# Altium project Bass Guitar Amp.PrjPcb (part 3 of 4)
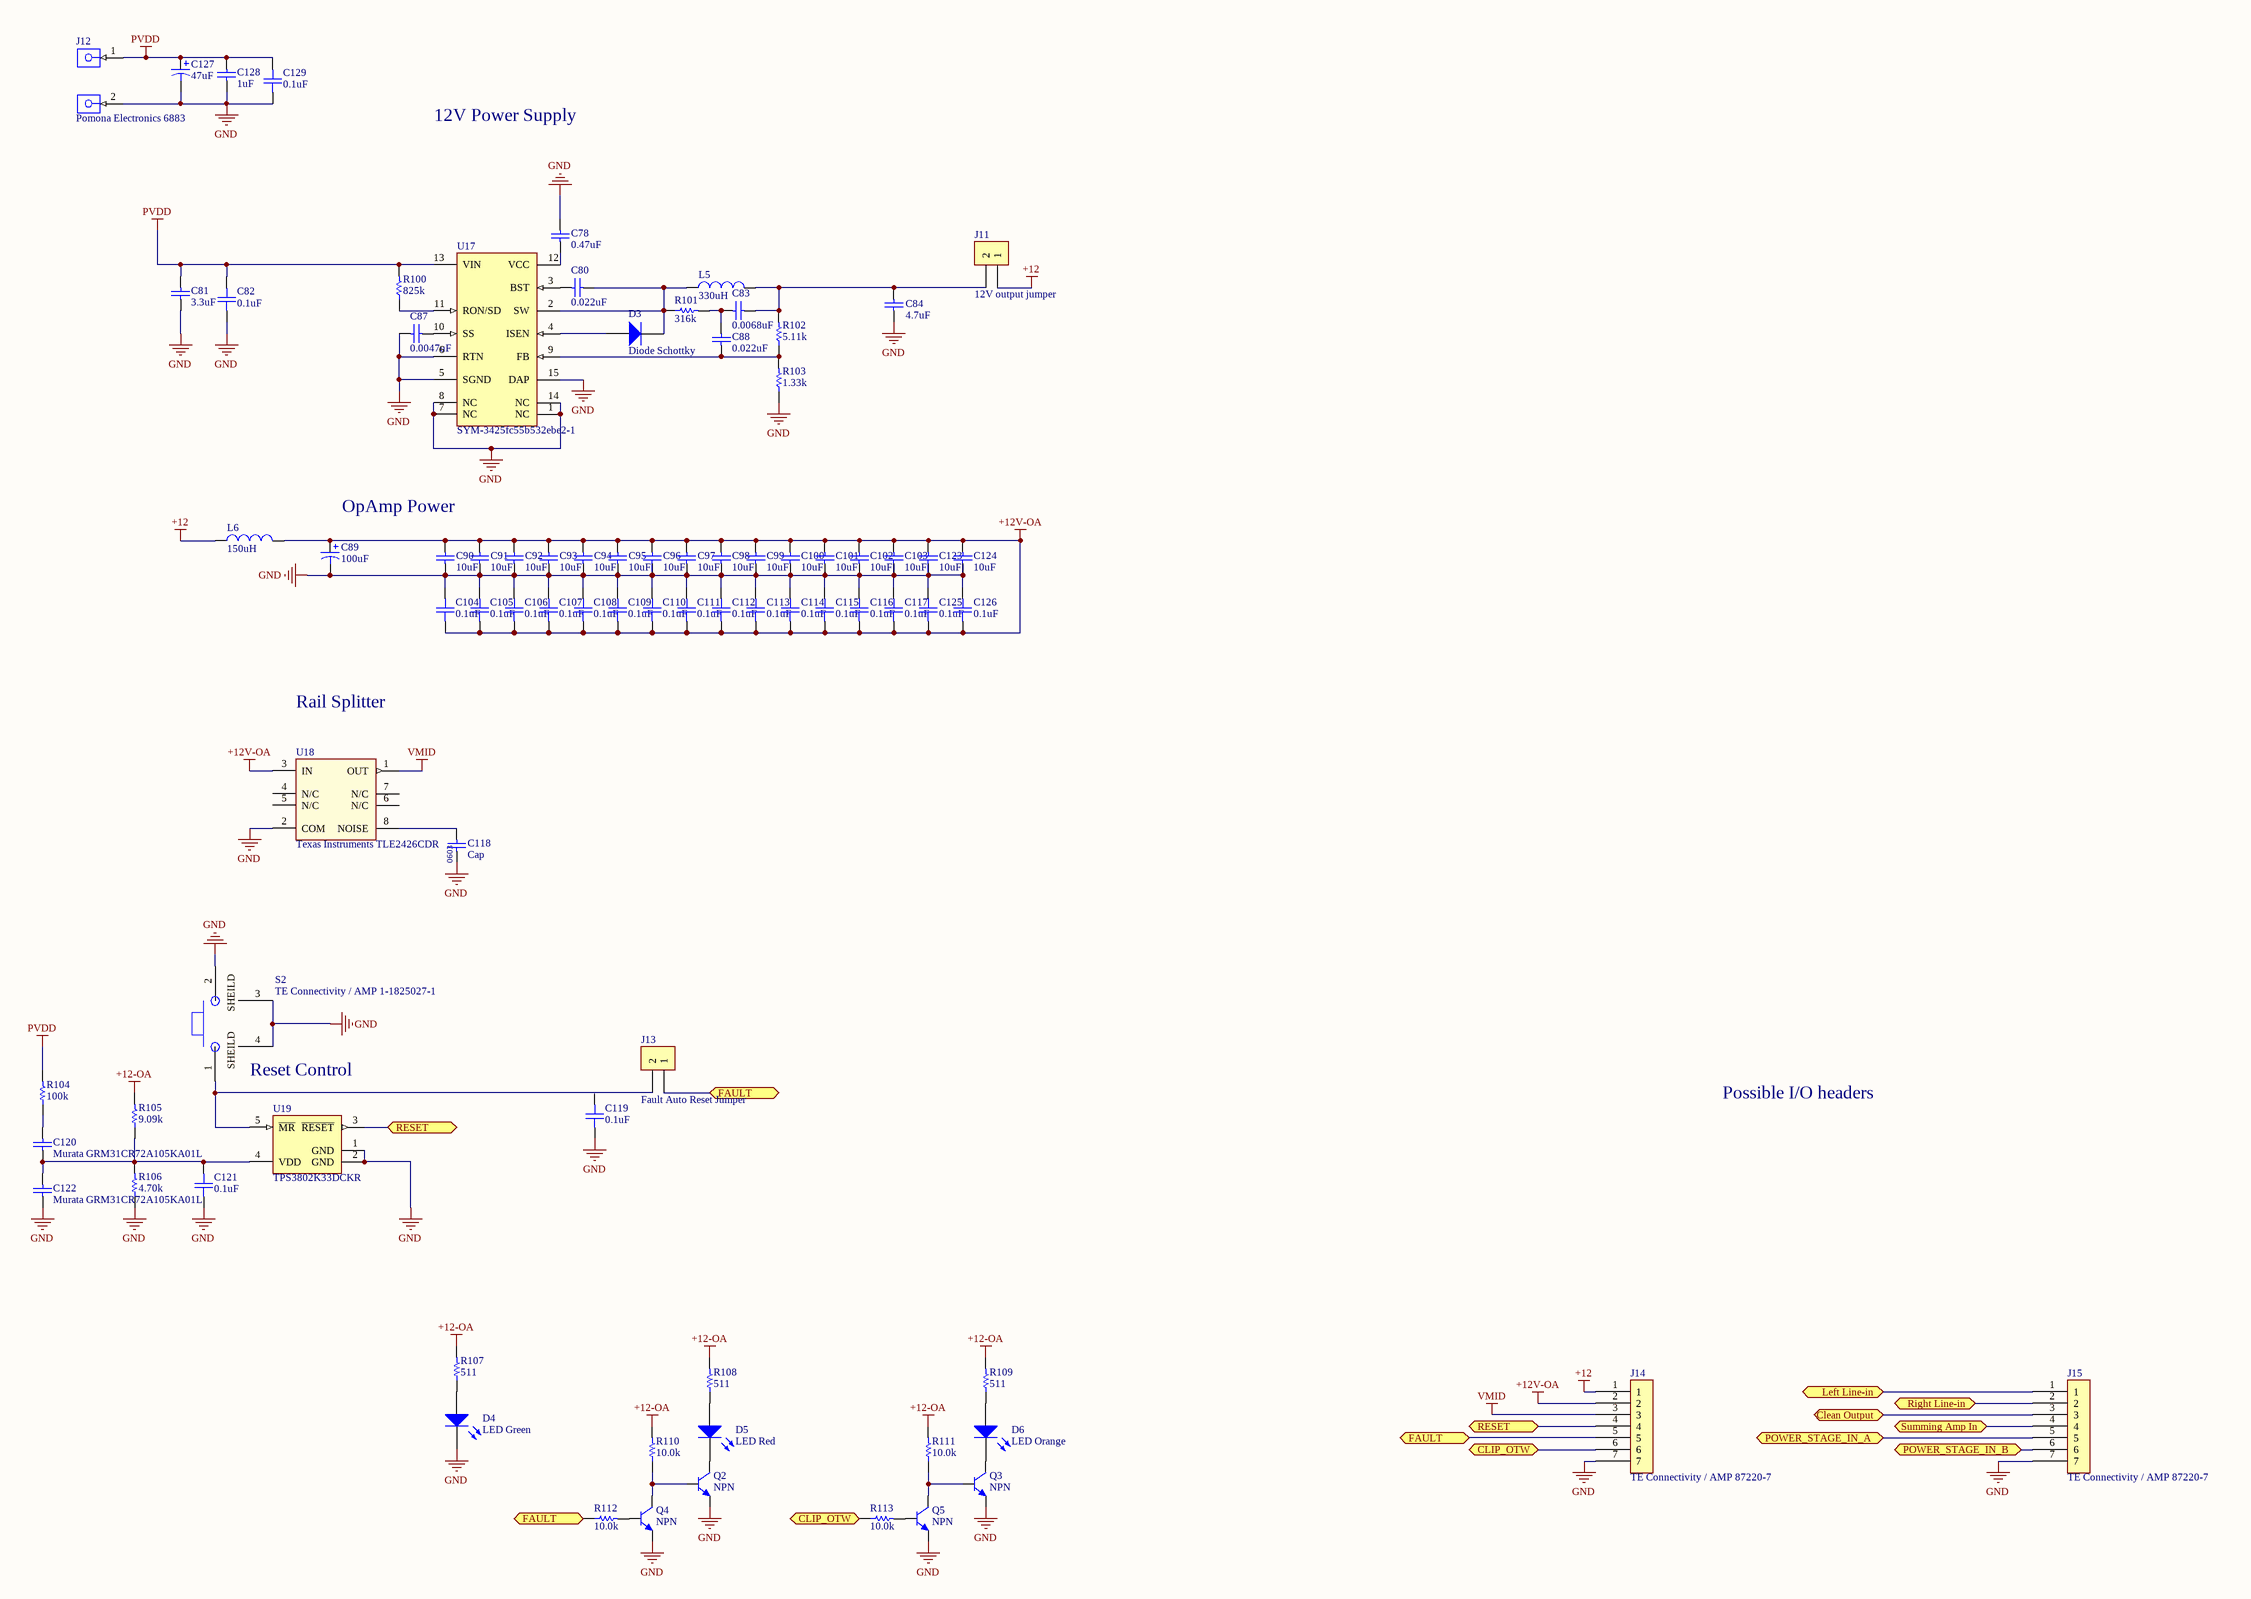
[diagram p6: Power Management.SchDoc]

## Sheet Power Management.SchDoc (continued)

### Library data of the parts (continued)
C89 = CMP-0978c15ef0cfd6bf-1 (continued):  Automotive T/R; Manufacturer Part Number: UCD1E101MCL1GS; Manufacturer: Nichicon; Voltage Rating (DC): 25.0 V
C90-C103 C123 C124 = CMP-a7396f2fa7ef78fe-6: CL31 Series 10 uF 25 V ±10 % Tolerance X7R SMT Multilayer Ceramic Capacitor; Voltage Rating (DC): 25.0 V; Capacitance Tolerance: ±10%; Capacitance: 10.0 µF; Lead-Free Status: Lead Free; Octopart URL: http://octopart.com/cl31b106kahnnne-samsung-18621872; Dielectric Characteristic: X7R; RoHS: Compliant; OctopartID: a7396f2fa7ef78fe; Case/Package: 1206
C118 = CMP-463c8d25af8a99fb-1: 0603 1 uF 16V ±10% Tolerance X7R SMT Multilayer Ceramic Capacitor; Manufacturer Part Number: GRM188R71C105KE15D; Capacitance: 1.00 µF; Voltage Rating (DC): 16.0 V; Case/Package (SI): 1608; Lead-Free Status: Lead Free; Size-Length: 1.60 mm; Case/Package: 0603, 1608; RoHS: Compliant; Size-Width: 800 µm; Lifecycle Status: Active; OctopartID: 463c8d25af8a99fb; Capacitance Tolerance: ±10%; Dielectric Characteristic: X7R
C120 C122 = CMP-19299756-2: CAP CER 1UF 100V 10% X7R 1206; Capacitance: 1e-06 F; Case/Package (SI): 3216; Dielectric Material: Ceramic Multilayer; Lead-Free Status: Lead Free; Voltage Rating (DC): 100.0 V; Capacitance Tolerance: ±10%; Dielectric Characteristic: X7R; Mounting Style: Surface Mount; Number of Pins: 2; Octopart Url: https://octopart.com/grm31cr72a105ka01l-murata-197461; OctopartID: bb66726f9d5564a1; REACH SVHC Compliance: No SVHC; RoHS: Compliant; Size-Length: 0.0032 m; Size-Thickness: 0.0016 m; Size-Width: 0.0016 m
C127 = CMP-6614abbd7d9eb9d3-1: Cap Aluminum Lytic 47uF 100V 20% (10 X 10.2mm) SMD 170mA 2000h 105C T/R
C128 = CMP-19299756-2: CAP CER 1UF 100V 10% X7R 1206; Manufacturer: Murata; Manufacturer Part Number: GRM31CR72A105KA01L; Capacitance: 1e-06 F; Case/Package (SI): 3216; Dielectric Material: Ceramic Multilayer; Lead-Free Status: Lead Free; Voltage Rating (DC): 100.0 V; Capacitance Tolerance: ±10%; Dielectric Characteristic: X7R; Mounting Style: Surface Mount; Number of Pins: 2; Octopart Url: https://octopart.com/grm31cr72a105ka01l-murata-197461; OctopartID: bb66726f9d5564a1; REACH SVHC Compliance: No SVHC; RoHS: Compliant; Size-Length: 0.0032 m; Size-Thickness: 0.0016 m; Size-Width: 0.0016 m
D3 = CMP-3c2bf027d984e3ec-1: 10 Amp 150V Ultra-Low VF schottky rectifier / TAPE REEL; Manufacturer Part Number: FSV10150V; Manufacturer: ON Semiconductor; Lead-Free Status: Lead Free; OctopartID: 3c2bf027d984e3ec; Octopart URL: http://octopart.com/fsv10150v-on+semiconductor-84328649; Lifecycle Status: Not Listed by Manufacturer; Mounting Style: Surface Mount
D4 = CMP-d13a1838906e0efd-2: Green 1.6 x 0.6 x 1.15 mm 130° Water Clear 18 to 78 mcd 2 V SMT LED; Manufacturer: Lite-On; Manufacturer Part Number: LTST-S270KGKT; Lens Type: Non-Diffused; Forward Voltage: 2.00 V; Luminous Intensity: 35.0 mcd; Case/Package (SI): 1608; Wavelength: 574 nm; Octopart URL: http://octopart.com/ltst-s270kgkt-lite-on-549938; OctopartID: d13a1838906e0efd; Viewing Angle: 130 °; Size-Height: 1.15 mm; Case/Package: 0603; Packaging: Cut Tape (CT), Tape & Reel (TR); Color: Green
D5 = CMP-1417dd155542cbd0-5: LED; SMD; 0604; red; 18-54mcd; 1.6x1.15x0.6mm; 130°; 2÷2.4V; 20mA; Manufacturer Part Number: LTST-S270KRKT; Manufacturer: Lite-On; Forward Voltage: 2.00 V; Wavelength: 639 nm; Luminous Intensity: 54.0 mcd; Lead-Free Status: Lead Free; Lens Type: Non-Diffused; Size-Width: 600 µm; Size-Length: 2.10 mm; Packaging: Cut Tape (CT), Tape & Reel (TR)
D6 = CMP-31d7f8d570b5ee10-2: Orange 1.6 x 0.6 mm 130º 90 mcd 2 V Water Clear Surface Mount Chip LED; Manufacturer Part Number: LTST-S270KFKT; Manufacturer: Lite-On; Lead-Free Status: Lead Free; Wavelength: 611 nm; Forward Voltage: 2.00 V; Luminous Intensity: 60.0 mcd; Lens Type: Non-Diffused; Mounting Style: Surface Mount; Packaging: Cut Tape (CT), Tape & Reel (TR); Color: Orange; OctopartID: 31d7f8d570b5ee10; Size-Width: 600 µm; RoHS: Compliant; Case/Package: 0603
J11 J13 = CMP-2792ecc2f21af855-16: Connector Unshrouded Header 2 Position 2.54mm Solder Straight Thru-Hole
J12 = CMP-19368571-3: DUAL BINDING POSTS; Wire Gauge: 12.0 AWG; Lead-Free Status: Lead Free; Current Rating: 30.0 A; Octopart Url: https://octopart.com/6883-pomona+electronics-2074; Mounting Style: Panel; OctopartID: 47678e6d6a1b98a0; RoHS: Compliant; Color: Black; Contact Plating: Nickel; Contact Material: Brass; REACH SVHC Compliance: No SVHC; Insulation Material: Nylon
J14 J15 = CMP-ebeb20bb2956342c-1: AMPMODU 7 Position Through-Hole Single Row Straight 0.1 Inch Header; Gender: Male; Lead-Free Status: Lead Free; Number of Positions: 7; Mounting Angle: 180 °; Pin Pitch: 2.54 mm; Housing Color: Black; RoHS: Compliant; Manufacturer Part Number: 87220-7; Orientation: Vertical; Octopart URL: http://octopart.com/87220-7-te+connectivity+%2F+amp-39512027; Size-Length: 17.4 mm; Packaging: Bulk; Flammability Rating: UL 94 V-0; Mounting Style: PCB; Color: Black; OctopartID: ebeb20bb2956342c; Lifecycle Status: Active; Number of Contacts: 7; Number of Rows: 1; Housing Material: Thermoplastic
L5 = CMP-f7073f765ac228c0-1: Power inductor, shielded, 10/20% tol, SMT, RoHS
L6 = CMP-1963d06f268dc6a4-1: SLF Series 12.5 x 12.5 mm 150 uH ±20 % Tol. 1.5 A Shielded SMT Power Inductor; Manufacturer Part Number: SLF12575T-151M1R5-PF; Manufacturer: TDK; Lead-Free Status: Lead Free; Shielding: Yes; Inductance: 150 µH; Mounting Style: Surface Mount; Octopart URL: http://octopart.com/slf12575t-151m1r5-pf-tdk-400008; OctopartID: 1963d06f268dc6a4; Packaging: Bulk, Tape & Reel (TR)
Q2-Q5 = CMP-857793-5: Bipolar (BJT) Single Transistor, General Purpose, NPN, 40 V, 300 MHz, 225 mW, 600 mA, 300
R100 = CMP-1319d8bf3abaccde-1: Res Thin Film 0603 825K Ohm 1% 1/10W ±50ppm/°C Molded SMD SMD Paper T/R; Lead-Free Status: Lead Free; Resistance: 825 kΩ; Voltage Rating (DC): 75.0 V; Mounting Style: Surface Mount; OctopartID: 1319d8bf3abaccde
R101 = CMP-8e64436f049d51a3-1: Surface Mount Thin Film Resistor, MCT Series, 316 kohm, 100 mW, - 0.1%, 75 V; Manufacturer: Vishay; Manufacturer Part Number: MCT06030E3163BP100; Resistance: 316 kΩ; Power Rating: 100 mW; Case/Package (SI): 1608; Lead-Free Status: Lead Free; Octopart URL: https://octopart.com/mct06030e3163bp100-vishay-67219359; RoHS: Compliant; Packaging: Cut Tape (CT); Resistance Tolerance: ±0.1%; OctopartID: 8e64436f049d51a3; REACH SVHC Compliance: No SVHC; Case/Package: 0603, 1608; Mounting Style: Surface Mount
R102 = CMP-3220f9ecb51bede7-1: Res Thin Film 0603 5.11K Ohm 0.1% 1/10W ±25ppm/°C Molded SMD SMD Paper T/R; Manufacturer Part Number: MCT06030D5111BP100; Power Rating: 100 mW; Octopart URL: http://octopart.com/mct06030d5111bp100-vishay-46572125; Packaging: Tape & Reel (TR); RoHS: Compliant
R103 = CMP-aade615395077519-1: Res Thnflm 0603 1.33k Ohm 0.1% 1/10w 25ppm/ c Smd
R104 = CMP-b20e79a018766dc9-1: MCT Series 0603 0.125 W 100 kOhm ±0.1% ±25 ppm/K SMT Thin Film Chip Resistor; Manufacturer: Vishay; Power Rating: 125 mW; Case/Package (SI): 1608; Mounting Style: Surface Mount; Octopart URL: http://octopart.com/mct0603md1003bp100-vishay-44338974; OctopartID: b20e79a018766dc9; Resistance Tolerance: ±0.1%; Packaging: Cut Tape (CT); Case/Package: 0603, 1608; RoHS: Compliant; Number of Pins: 2
R105 = CMP-504998d4ca0f8f8e-1: Res Smd 9.09k Ohm 0.1% 1/8w 0603; Manufacturer: Vishay; Manufacturer Part Number: MCT0603MD9091BP100; OctopartID: 504998d4ca0f8f8e; Case/Package: 0603; Octopart URL: http://octopart.com/mct0603md9091bp100-vishay+beyschlag-26722080; Resistance: 9.09k; Packaging: Reel
R106 = CMP-2ab0e11e80e8f577-1: Surface Mount Chip Resistor, Thin Film, MCT Series, 4.7 kohm, 125 mW, 0.1%, 75 V
R107-R109 = CMP-7c87b70a42aea340-1: Res Thin Film 0603 511 Ohm 0.1% 1/10W ±25ppm/°C Molded SMD SMD Paper T/R
R110-R113 = CMP-893e42b9f3a056f9-1: Precision Thin Film Smnt Resistor 0603 Case 10kOhm +/-0.1% 0.1W +/-25ppm/degC; Manufacturer: Vishay; Manufacturer Part Number: MCT06030D1002BP100; Lead-Free Status: Lead Free; Resistance Tolerance: ±0.1%; Voltage Rating (DC): 50.0 V; Resistance: 10.0 kΩ; Power Rating: 100 mW; Packaging: Tape & Reel (TR); RoHS: Compliant; Mounting Style: Surface Mount; Size-Length: 1.55 mm; Size-Width: 850 µm; Octopart URL: http://octopart.com/mct06030d1002bp100-vishay-42819576; Case/Package: 0603; Size-Height: 450 µm
S2 = CMP-4d86860896969241-7: Switch Push Button OFF (ON) SPST Round Button 0.05A 24VDC Momentary Contact PC Pins Thru-Hole; Mounting Style: Through Hole
U17 = CMP-3425fc55b532ebe2-1: 8-75V Wide Vin, 1A Constant On-Time Non-Synchronous Buck egulator 14-HTSSOP -40 to 125; Manufacturer Part Number: LM5010MHX/NOPB; Lead-Free Status: Lead Free; Switching Frequency: 1.00 MHz; Quiescent Current: 650 µA; Output Voltage: 2.50 V (min); Output Current: 1.00 A; Number of Regulated Outputs: 1; Octopart URL: http://octopart.com/lm5010mhx%2Fnopb-texas+instruments-24814705; Topology: Buck; RoHS: Compliant; Packaging: Cut Tape (CT); Case/Package: HTSSOP; OctopartID: 3425fc55b532ebe2
U18 = CMP-84004d2919695bc7-1: The ' ail Splitter' Precision Virtual Ground 8-SOIC; Manufacturer Part Number: TLE2426CDG4; Manufacturer: TI; Lead-Free Status: Lead Free; Supply Voltage (DC): 4.00 V (min); Octopart URL: http://octopart.com/tle2426cdg4-texas+instruments-2340879; Case/Package: SOIC, PDIP; Packaging: Tube; Mounting Style: Surface Mount; OctopartID: 84004d2919695bc7; RoHS: Compliant; Lifecycle Status: Active; Number of Pins: 8
U19 = CMP-4881249-2: Ultra-Small Supply Voltage Supervisor, 1 Supply Monitored, -40 to 85 degC, 5-pin SC70 (DCK), Green (RoHS & no Sb/Br); Lead-Free Status: Lead Free; Quiescent Current: 9e-06 A; Supply Current: 1.3e-05 A; Threshold Voltage: 2.93 V; Case/Package: SOT-323; Lifecycle Status: Active; Mounting Style: Surface Mount; Number of Pins: 5; Octopart Url: https://octopart.com/tps3802k33dckr-texas+instruments-505797; OctopartID: 3e03f70eaca0e1c4; Packaging: Cut Tape (CT); REACH SVHC Compliance: No SVHC; RoHS: Compliant

## Sheet Power Stage.SchDoc
size C
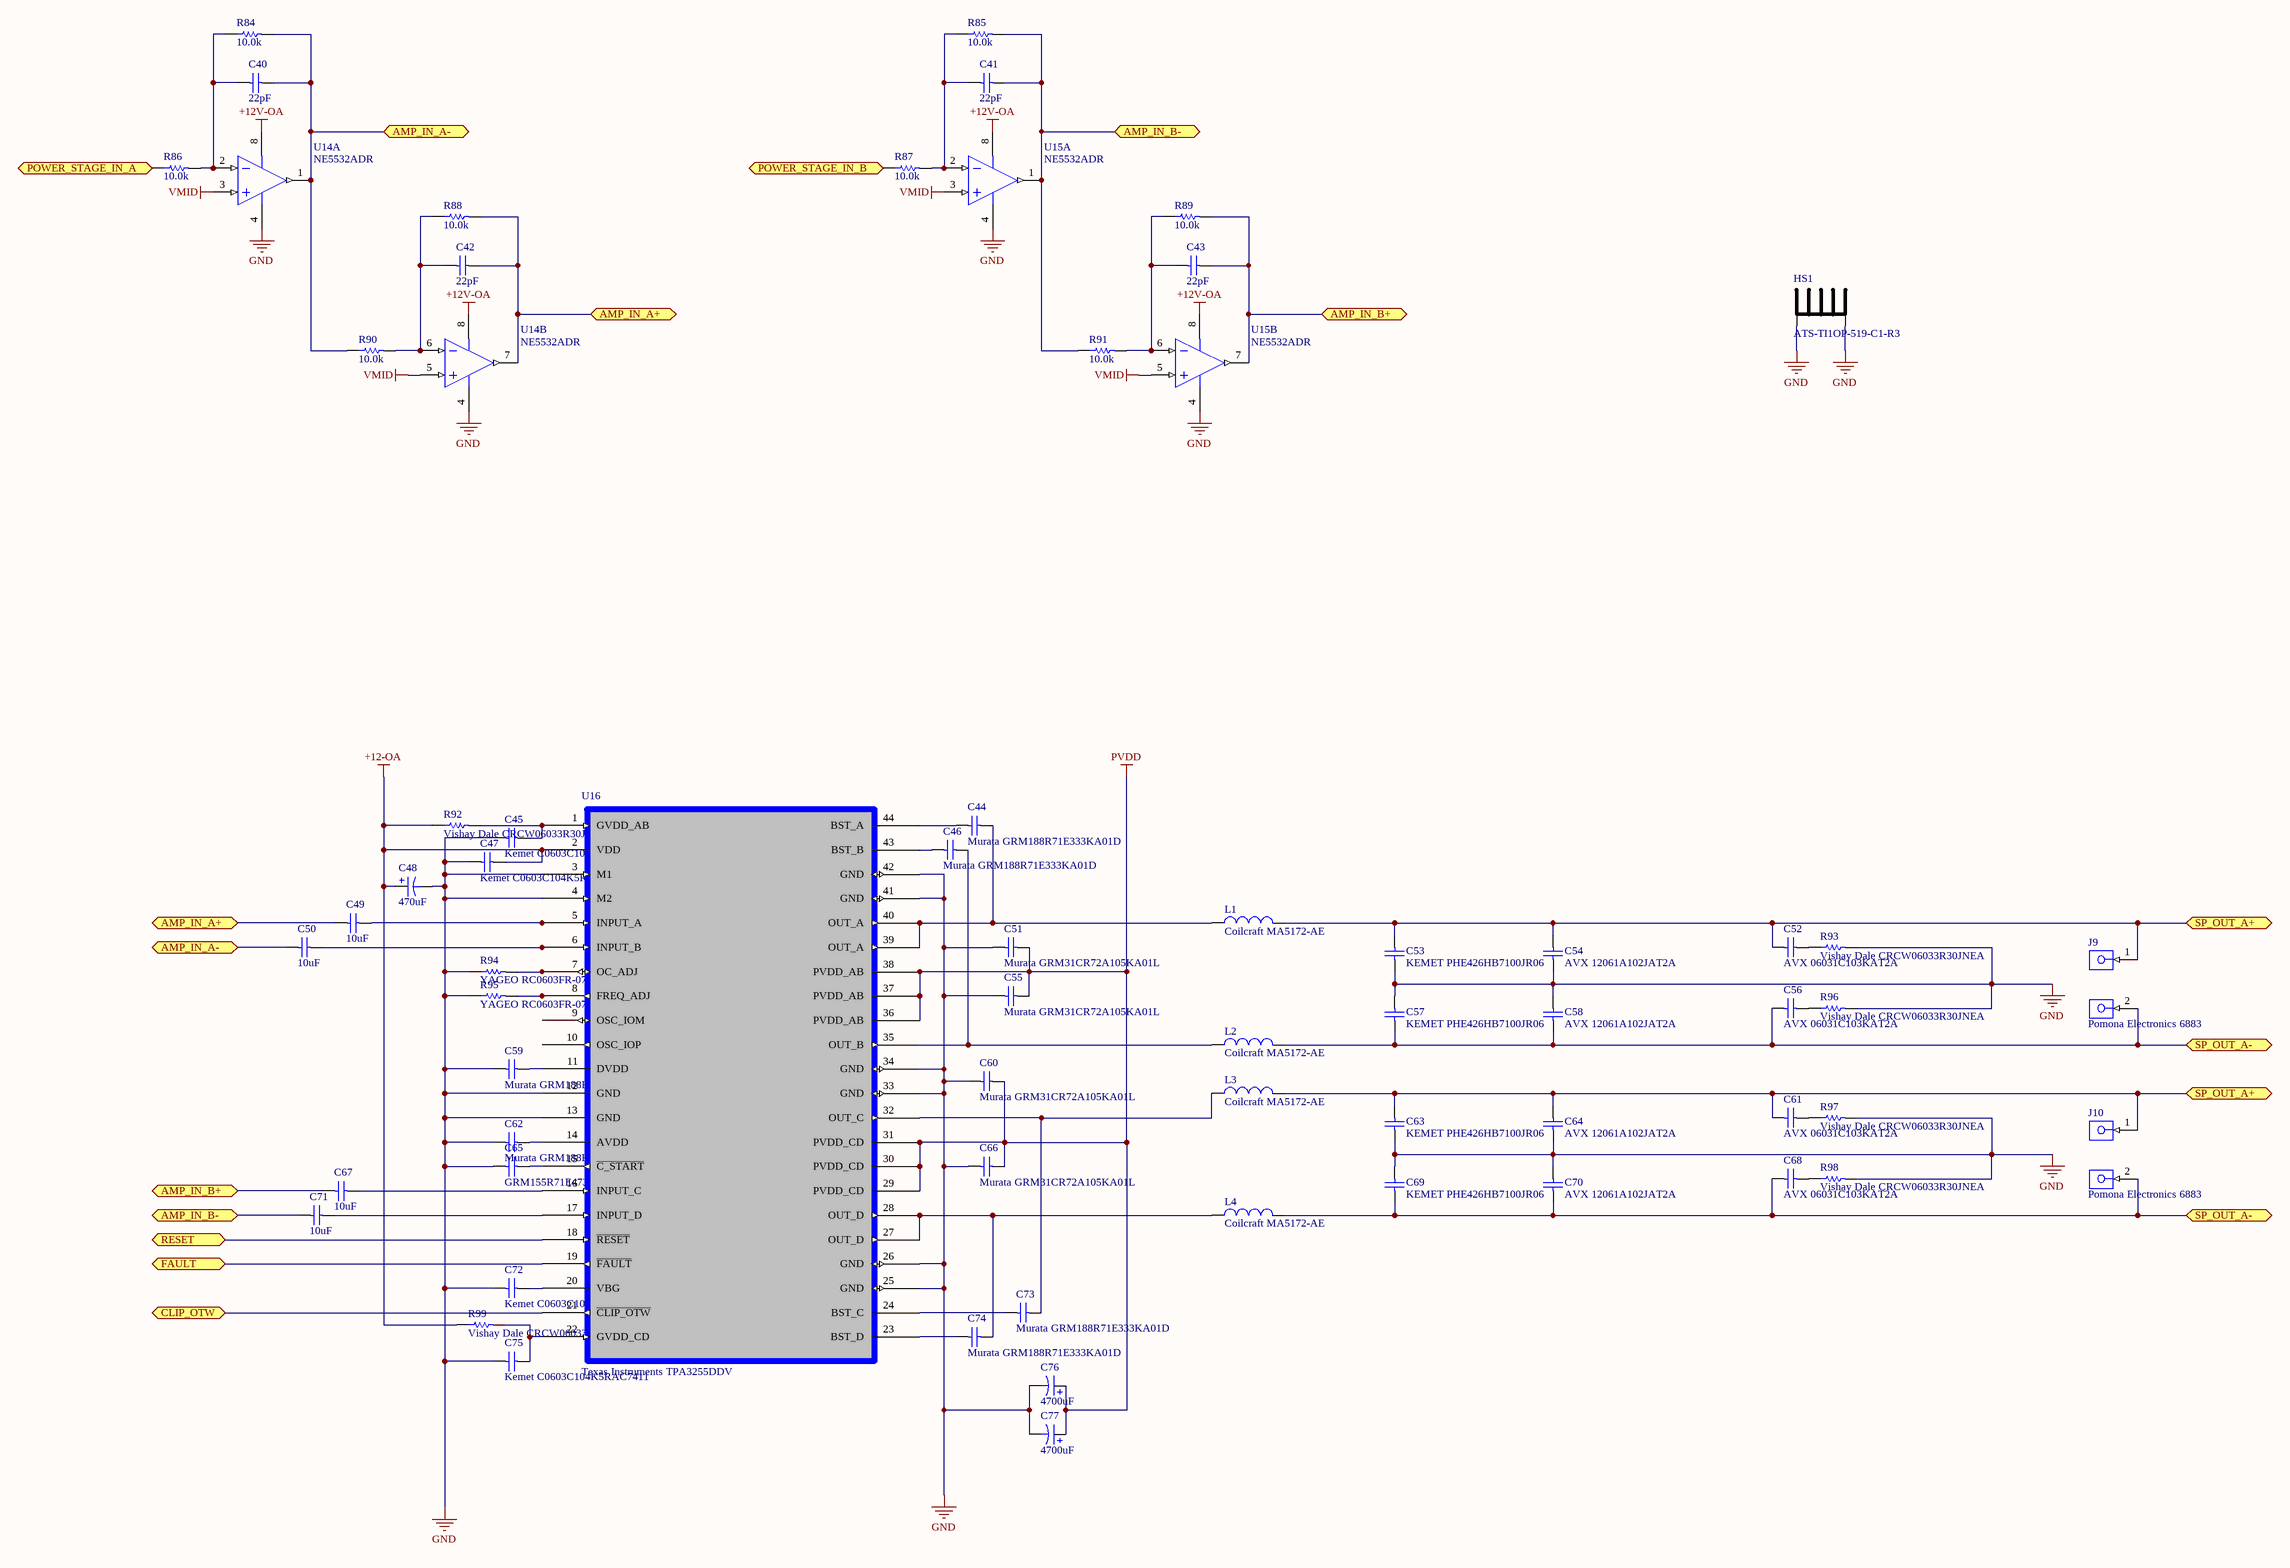
[diagram p3: Power Stage.SchDoc]

### Parts
(Parts that share a designator on the sheet are numbered #1, #2 ... from top to bottom, then left to right.)
C40  22pF  [PCB-o7p1koxmr9wqz41gh50t-1]
C41  22pF  [PCB-o7p1koxmr9wqz41gh50t-1]
C42  22pF  [PCB-o7p1koxmr9wqz41gh50t-1]
C43  22pF  [PCB-o7p1koxmr9wqz41gh50t-1]
C44  Murata GRM188R71E333KA01D  [CAPC1608X90X35ML10T15]
C45  Kemet C0603C104K5RAC7411  [CAPC1608X90X35LL15T15]
C46  Murata GRM188R71E333KA01D  [CAPC1608X90X35ML10T15]
C47  Kemet C0603C104K5RAC7411  [CAPC1608X90X35LL15T15]
C48  470uF  [PCB-mh51ry34akxvihba7d1m-1]
C49  10uF  [PCB-5c5sxu4lzqbcrp2k6kwf-1]
C50  10uF  [PCB-5c5sxu4lzqbcrp2k6kwf-1]
C51  Murata GRM31CR72A105KA01L  [CAPC3216X180X55NL20T25]
C52  AVX 06031C103KAT2A  [CAPC1608X90X35LL15T15]
C53  KEMET PHE426HB7100JR06  [PCB-ic7teet39ogb6vct1pyo-1]
C54  AVX 12061A102JAT2A  [CAPC3216X94X50ML20T25]
C55  Murata GRM31CR72A105KA01L  [CAPC3216X180X55NL20T25]
C56  AVX 06031C103KAT2A  [CAPC1608X90X35LL15T15]
C57  KEMET PHE426HB7100JR06  [PCB-ic7teet39ogb6vct1pyo-1]
C58  AVX 12061A102JAT2A  [CAPC3216X94X50ML20T25]
C59  Murata GRM188R71C105KA12D  [CAPC1608X90X35ML10T15]
C60  Murata GRM31CR72A105KA01L  [CAPC3216X180X55NL20T25]
C61  AVX 06031C103KAT2A  [CAPC1608X90X35LL15T15]
C62  Murata GRM188R71C105KA12D  [CAPC1608X90X35ML10T15]
C63  KEMET PHE426HB7100JR06  [PCB-ic7teet39ogb6vct1pyo-1]
C64  AVX 12061A102JAT2A  [CAPC3216X94X50ML20T25]
C65  GRM155R71E473KA88D  [PCB-8qa0kx9mzhbv2uzo5c36-1]
C66  Murata GRM31CR72A105KA01L  [CAPC3216X180X55NL20T25]
C67  10uF  [PCB-5c5sxu4lzqbcrp2k6kwf-1]
C68  AVX 06031C103KAT2A  [CAPC1608X90X35LL15T15]
C69  KEMET PHE426HB7100JR06  [PCB-ic7teet39ogb6vct1pyo-1]
C70  AVX 12061A102JAT2A  [CAPC3216X94X50ML20T25]
C71  10uF  [PCB-5c5sxu4lzqbcrp2k6kwf-1]
C72  Kemet C0603C104K5RAC7411  [CAPC1608X90X35LL15T15]
C73  Murata GRM188R71E333KA01D  [CAPC1608X90X35ML10T15]
C74  Murata GRM188R71E333KA01D  [CAPC1608X90X35ML10T15]
C75  Kemet C0603C104K5RAC7411  [CAPC1608X90X35LL15T15]
C76  4700uF  [PCB-qf4499uy3mgf4sz8oa02-1]
C77  4700uF  [PCB-qf4499uy3mgf4sz8oa02-1]
HS1  ATS-TI1OP-519-C1-R3  [PCB-12h1wxpnvqqah717yr6c-1]
J9  Pomona Electronics 6883  [PCB-19368571-1]
J10  Pomona Electronics 6883  [PCB-19368571-1]
L1  Coilcraft MA5172-AE  [PCB-io1gjfmxuwzc4adtdchi-1]
L2  Coilcraft MA5172-AE  [PCB-io1gjfmxuwzc4adtdchi-1]
L3  Coilcraft MA5172-AE  [PCB-io1gjfmxuwzc4adtdchi-1]
L4  Coilcraft MA5172-AE  [PCB-io1gjfmxuwzc4adtdchi-1]
R84  10.0k  [RESC1609X55X28LL05T18]
R85  10.0k  [RESC1609X55X28LL05T18]
R86  10.0k  [RESC1609X55X28LL05T18]
R87  10.0k  [RESC1609X55X28LL05T18]
R88  10.0k  [RESC1609X55X28LL05T18]
R89  10.0k  [RESC1609X55X28LL05T18]
R90  10.0k  [RESC1609X55X28LL05T18]
R91  10.0k  [RESC1609X55X28LL05T18]
R92  Vishay Dale CRCW06033R30JNEA  [RESC1609X50X30ML10T20]
R93  Vishay Dale CRCW06033R30JNEA  [RESC1609X50X30ML10T20]
R94  YAGEO RC0603FR-0730KL  [R0603_A]
R95  YAGEO RC0603FR-0730KL  [R0603_A]
R96  Vishay Dale CRCW06033R30JNEA  [RESC1609X50X30ML10T20]
R97  Vishay Dale CRCW06033R30JNEA  [RESC1609X50X30ML10T20]
R98  Vishay Dale CRCW06033R30JNEA  [RESC1609X50X30ML10T20]
R99  Vishay Dale CRCW06033R30JNEA  [RESC1609X50X30ML10T20]
U14#1  NE5532ADR  [TI-D8_L]  (part A of 2)
U14#2  NE5532ADR  [TI-D8_L]  (part B of 2)
U15#1  NE5532ADR  [TI-D8_L]  (part A of 2)
U15#2  NE5532ADR  [TI-D8_L]  (part B of 2)
U16  Texas Instruments TPA3255DDV  [PCB-jx1m9m1tq16w1ds4d00h-1]

### Ports
AMP_IN_A+, AMP_IN_A-, AMP_IN_B+, AMP_IN_B-, CLIP_OTW, FAULT, POWER_STAGE_IN_A, POWER_STAGE_IN_B, RESET, SP_OUT_A+, SP_OUT_A-

### Nets
+12-OA: C47.2 C48.1 R92.1 R99.1 U16.2(VDD)
+12V-OA: U14#1.8(VCC+) U14#2.8(VCC+) U15#1.8(VCC+) U15#2.8(VCC+)
GND: C45.1 C47.1 C48.2 C51.1 C53.1 C54.1 C55.1 C57.1 C58.2 C59.1 C60.1 C62.1 C63.1 C64.1 C65.1 C66.1 C69.1 C70.2 C72.1 C75.1 C76.2 C77.2 HS1.1 HS1.2 R93.2 R94.1 R95.1 R96.2 R97.2 R98.2 U14#1.4(VCC-) U14#2.4(VCC-) U15#1.4(VCC-) U15#2.4(VCC-) U16.3(M1) U16.4(M2) U16.12(GND) U16.13(GND) U16.25(GND) U16.26(GND) U16.33(GND) U16.34(GND) U16.41(GND) U16.42(GND)
PVDD: C51.2 C55.2 C60.2 C66.2 C76.1 C77.1 U16.29(PVDD_CD) U16.30(PVDD_CD) U16.31(PVDD_CD) U16.36(PVDD_AB) U16.37(PVDD_AB) U16.38(PVDD_AB)
VMID: U14#1.3(IN1+) U14#2.5(IN2+) U15#1.3(IN1+) U15#2.5(IN2+)
NetC40_1: C40.1 R84.1 R86.2 U14#1.2(IN1-)
NetC40_2: C40.2 C50.1 R84.2 R90.1 U14#1.1(OUT1) ; port AMP_IN_A-
NetC41_1: C41.1 R85.1 R87.2 U15#1.2(IN1-)
NetC41_2: C41.2 C71.1 R85.2 R91.1 U15#1.1(OUT1) ; port AMP_IN_B-
NetC42_1: C42.1 R88.1 R90.2 U14#2.6(IN2-)
NetC42_2: C42.2 C49.1 R88.2 U14#2.7(OUT2) ; port AMP_IN_A+
NetC43_1: C43.1 R89.1 R91.2 U15#2.6(IN2-)
NetC43_2: C43.2 C67.1 R89.2 U15#2.7(OUT2) ; port AMP_IN_B+
NetC44_1: C44.1 U16.44(BST_A)
NetC44_2: C44.2 L1.1 U16.39(OUT_A) U16.40(OUT_A)
NetC45_2: C45.2 R92.2 U16.1(GVDD_AB)
NetC46_1: C46.1 U16.43(BST_B)
NetC46_2: C46.2 L2.1 U16.35(OUT_B)
NetC49_2: C49.2 U16.5(INPUT_A)
NetC50_2: C50.2 U16.6(INPUT_B)
NetC52_1: C52.1 C53.2 C54.2 C61.1 C63.2 C64.2 J9.1(+) J10.1(+) L1.2 L3.2 ; port SP_OUT_A+
NetC52_2: C52.2 R93.1
NetC56_1: C56.1 C57.2 C58.1 C68.1 C69.2 C70.1 J9.2(-) J10.2(-) L2.2 L4.2 ; port SP_OUT_A-
NetC56_2: C56.2 R96.1
NetC59_2: C59.2 U16.11(DVDD)
NetC61_2: C61.2 R97.1
NetC62_2: C62.2 U16.14(AVDD)
NetC65_2: C65.2 U16.15(~{C_START})
NetC67_2: C67.2 U16.16(INPUT_C)
NetC68_2: C68.2 R98.1
NetC71_2: C71.2 U16.17(INPUT_D)
NetC72_2: C72.2 U16.20(VBG)
NetC73_1: C73.1 U16.24(BST_C)
NetC73_2: C73.2 L3.1 U16.32(OUT_C)
NetC74_1: C74.1 U16.23(BST_D)
NetC74_2: C74.2 L4.1 U16.27(OUT_D) U16.28(OUT_D)
NetC75_2: C75.2 R99.2 U16.22(GVDD_CD)
NetJ3_2: R86.1 ; port POWER_STAGE_IN_A
NetJ3_7: R87.1 ; port POWER_STAGE_IN_B
NetJ13_1: U16.19(~{FAULT}) ; port FAULT
NetJ14_4: U16.18(~{RESET}) ; port RESET
NetJ14_6: U16.21(~{CLIP_OTW}) ; port CLIP_OTW
NetR94_2: R94.2 U16.7(OC_ADJ)
NetR95_2: R95.2 U16.8(FREQ_ADJ)

Not connected (* = marked no-connect by the designer): U16 9(OSC_IOM) 10(OSC_IOP)

### Library data of the parts
C40-C43 = CMP-5839914dedd787fe-1: CL10 Series 22 pF 50V ±5 % Tolerance C0G SMT Multilayer Ceramic Capacitor; Manufacturer: Samsung; Manufacturer Part Number: CL10C220JB8NNNC; Dielectric Characteristic: C0G/NP0; Octopart URL: http://octopart.com/cl10c220jb8nnnc-samsung-8294536; Mounting Style: Surface Mount
C44 C46 C73 C74 = CMP-19299719-3: CAP CER 0.033UF 25V 10% X7R 0603; Capacitance: 3.3e-08 F; Case/Package (SI): 1608; Lead-Free Status: Lead Free; Voltage Rating (DC): 25.0 V; Capacitance Tolerance: ±10%; Dielectric Characteristic: X7R; Lifecycle Status: Active; Mounting Style: Surface Mount; Number of Pins: 2; Octopart Url: https://octopart.com/grm188r71e333ka01d-murata-196236; OctopartID: 30a0f9a8eb4aef67; Packaging: Cut Tape (CT); REACH SVHC Compliance: No SVHC; RoHS: Compliant; Size-Height: 0.0008 m; Size-Length: 0.0016 m; Size-Thickness: 0.0008 m; Size-Width: 0.0008 m
C45 C47 C72 C75 = CMP-2758709-2: Cap Ceramic 0.1uF 50V X7R 10% SMD 0603 125C Paper T/R; Capacitance: 1e-07 F; Lead-Free Status: R; Voltage Rating (DC): 50.0 V; Capacitance Tolerance: ±10%; Case/Package: 0603; Dielectric Characteristic: X7R; Dielectric Material: Ceramic; Mounting Style: Surface Mount; Octopart Url: https://octopart.com/c0603c104k5rac7411-kemet-17707643; OctopartID: 1adbd2df0dc6c51c; RoHS: Compliant
C48 = CMP-b5917dc82bc86a56-2: Cap Aluminum 470uF 25V 20% (10 X 12mm) Radial Aluminum Cylindrical Can 5mm 460mA 2000 hr 85°C Ammo Pack; Manufacturer: Kemet; Manufacturer Part Number: ESK477M025AH1EA; Octopart URL: https://octopart.com/esk477m025ah1ea-kemet-22264639; Capacitance: 470uF
C49 C50 C67 C71 = CMP-f13b3967d5202efc-1: Cap Film 10uF 63V PET 5% (26.5 X 8.5 X 17mm) Radial Wound 22.5mm 105C Automotive Bulk; Manufacturer Part Number: 60DN51005030J; Manufacturer: Kemet; RoHS: Compliant; Capacitance: 10uF; OctopartID: f13b3967d5202efc
C51 C55 C60 C66 = CMP-19299756-2: as C120 on sheet Power Management; Capacitance Tolerance: ±10%; Dielectric Characteristic: X7R; Mounting Style: Surface Mount; Number of Pins: 2; Octopart Url: https://octopart.com/grm31cr72a105ka01l-murata-197461; OctopartID: bb66726f9d5564a1; REACH SVHC Compliance: No SVHC; RoHS: Compliant; Size-Length: 0.0032 m; Size-Thickness: 0.0016 m; Size-Width: 0.0016 m
C52 C56 C61 C68 = CMP-126723-2: CAP CER 10000PF 100V X7R 0603; Capacitance: 1e-08 F; Capacitance Tolerance: ±10%; Dielectric Material: Ceramic Multilayer; Insulation Resistance: 1e+11 Ω; Lead-Free Status: Lead Free; Voltage Rating (DC): 100.0 V; Case/Package: 0603; Dielectric Characteristic: X7R; Mounting Style: Surface Mount; Number of Pins: 2; Octopart Url: https://octopart.com/06031c103kat2a-avx+interconnect+%2F+elco-52539; OctopartID: 17f3def9ffaec834; REACH SVHC Compliance: No SVHC; RoHS: Compliant; Size-Height: 0.00086 m; Size-Length: 0.0016 m; Size-Width: 0.00081 m
C53 C57 C63 C69 = CMP-500699cc293d8fc1-1: Capacitor: polypropylene; 1uF; 15mm; ±5%; 9.5x17.5x18mm; -55÷105°C
C54 C58 C64 C70 = CMP-127042-2: CAP CER 1000PF 100V 5% NP0 1206; Capacitance: 1e-09 F; Case/Package (SI): 3216; Dielectric Characteristic: C0G/NP0; Dielectric Material: Ceramic Multilayer; Insulation Resistance: 1e+11 Ω; Lead-Free Status: Lead Free; Voltage Rating (DC): 100.0 V; Capacitance Tolerance: ±5%; Case/Package: 1206; Mounting Style: Surface Mount; Number of Pins: 2; Octopart Url: https://octopart.com/12061a102jat2a-avx+interconnect+%2F+elco-40101059; OctopartID: f6683d0137cd29af; REACH SVHC Compliance: No SVHC; RoHS: Compliant; Size-Height: 0.00094 m; Size-Length: 0.0032004 m; Size-Thickness: 0.0009398 m; Size-Width: 0.0016002 m
C59 C62 = CMP-121260-3: CAP CER 1UF 16V 10% X7R 0603; Capacitance: 1e-06 F; Case/Package (SI): 1608; Lead-Free Status: Lead Free; Voltage Rating (DC): 16.0 V; Capacitance Tolerance: ±10%; Dielectric Characteristic: X7R; Lifecycle Status: Active; Mounting Style: Surface Mount; Number of Pins: 2; Octopart Url: https://octopart.com/grm188r71c105ka12d-murata-197452; OctopartID: 978b5e82b1a1484c; REACH SVHC Compliance: No SVHC; RoHS: Compliant; Size-Height: 0.0008 m; Size-Length: 0.0016 m; Size-Thickness: 0.0008 m; Size-Width: 0.0008 m
C65 = CMP-19299683-4: CAP CER 0.047UF 25V 10% X7R 0402; Lead-Free Status: Lead Free; Voltage Rating (DC): 25.0 V; Capacitance: 4.7e-08 F; Dielectric Characteristic: X7R; OctopartID: 4d90849969ff9257; Number of Pins: 2; Size-Height: 0.0005 m; Size-Length: 0.001 m; Mounting Style: Surface Mount; RoHS: Compliant; REACH SVHC Compliance: No SVHC; Size-Width: 0.0005 m; Case/Package: 0402; Size-Thickness: 0.0005 m; Lifecycle Status: Active; Capacitance Tolerance: ±10%; Octopart Url: https://octopart.com/grm155r71e473ka88d-murata-196873; Manufacturer Part Number: GRM155R71E473KA88D
C76 C77 = CMP-bee1779c35af6126-4: Cap Aluminum Lytic 4700uF 80V 20% (35 X 30mm) Snap-In 10mm 0.071 Ohm 4120mA 3000h 85°C; Equivalent Series Resistance (ESR): 71.0 mΩ; Voltage Rating (DC): 80.0 V; Capacitance Tolerance: ±20%; Octopart URL: http://octopart.com/slpx472m080h3p3-cornell+dubilier-7843368; RoHS: Compliant; Number of Pins: 2; Size-Diameter: 35.0 mm; Mounting Style: PCB
HS1 = CMP-2fbfe5832fc9f078-1: Heatsink Ti Tas5622 And Tas5624; Manufacturer Part Number: ATS-TI1OP-519-C1-R3
J9 = CMP-19368571-3: DUAL BINDING POSTS; Manufacturer Part Number: 6883; Wire Gauge: 12.0 AWG; Lead-Free Status: Lead Free; Current Rating: 30.0 A; Octopart Url: https://octopart.com/6883-pomona+electronics-2074; Mounting Style: Panel; OctopartID: 47678e6d6a1b98a0; RoHS: Compliant; Color: Black; Contact Plating: Nickel; Contact Material: Brass; REACH SVHC Compliance: No SVHC; Insulation Material: Nylon; Manufacturer: Pomona Electronics
J10 = CMP-19368571-3: as J12 on sheet Power Management; Octopart Url: https://octopart.com/6883-pomona+electronics-2074; Mounting Style: Panel; OctopartID: 47678e6d6a1b98a0; RoHS: Compliant; Color: Black; Contact Plating: Nickel; Contact Material: Brass; REACH SVHC Compliance: No SVHC; Insulation Material: Nylon
L1-L4 = CMP-8fb2478ced515075-1: Power inductor, for TI TAS5612/5614, RoHS, halogen-free; Lead-Free Status: Contains Lead; Inductance: 10.0 µH; Octopart URL: http://octopart.com/ma5172-ae-coilcraft-20203397; Manufacturer Part Number: MA5172-AE; RoHS: Compliant; Mounting Style: Through Hole; Lifecycle Status: Active; OctopartID: 8fb2478ced515075
R84-R91 = CMP-893e42b9f3a056f9-1: as R110-R113 on sheet Power Management; Packaging: Tape & Reel (TR); RoHS: Compliant; Mounting Style: Surface Mount; Size-Length: 1.55 mm; Size-Width: 850 µm; Octopart URL: http://octopart.com/mct06030d1002bp100-vishay-42819576; Case/Package: 0603; Size-Height: 450 µm
R92 R93 R96-R99 = CMP-1856160-2: RES SMD 3.3 OHM 5% 1/10W 0603; Lead-Free Status: Lead Free; Power Rating: 0.1 W; Resistance: 3.3 Ω; Temperature Coefficient: 200.0 ppm/°C; Voltage Rating (DC): 75.0 V; Case/Package: 0603; Mounting Style: Surface Mount; Octopart Url: https://octopart.com/crcw06033r30jnea-vishay-46591553; OctopartID: 1644dd88dd63c983; Resistance Tolerance: ±5%; RoHS: Compliant; Size-Height: 0.00045 m; Size-Length: 0.00155 m; Size-Width: 0.00085 m
R94 R95 = CMP-d4a11db8f0250b66-2: RC Series 0603 0.1 W 30 kOhms 1% ±100 ppm/°C SMT Thick Film Chip Resistor; Resistance: 30000.0 Ω; Lead-Free Status: Lead Free; Voltage Rating (DC): 50.0 V; Power Rating: 0.1 W; Size-Length: 0.0016 m; Seller Landing  Url: https://octopart-clicks.com/click/track?country=US&ak=8157f166&sig=03c48b9&sid=5489&ppid=1245666&vpid=190517090&ct=offers; Size-Height: 0.00045 m; Case/Package: 0603; Size-Width: 0.0008 m; Octopart Url: http://octopart.com/rc0603fr-0730kl-yageo-1245666; Resistance Tolerance: ±1%; Mounting Style: Surface Mount; Manufacturer Part Number: RC0603FR-0730KL; RoHS: Compliant; OctopartID: d4a11db8f0250b66; Number of Pins: 2
U14#1 U14#2 U15#1 U15#2 = CMP-13597030-2: Dual Low-Noise Operational Amplifier, 10 to 30 V, 0 to 70 degC, 8-pin SOIC (D8), Green (RoHS & no Sb/Br); Bandwidth: 10000000.0 Hz; Lead-Free Status: Lead Free; Number of Channels: 2; Slew Rate: 9.0 V/μs; Supply Voltage (DC): 30.0 V; Gain Bandwidth Product: 10000000.0 Hz; Lifecycle Status: Active; Mounting Style: Surface Mount; Number of Circuits: 2; Number of Pins: 8; Octopart Url: https://octopart.com/ne5532adr-texas+instruments-409175; OctopartID: 270fee033c3ef8c8; Packaging: Tape & Reel (TR); REACH SVHC Compliance: No SVHC; RoHS: Compliant
U16 = CMP-2f15e2605fa2f0d2-3: Audio Amp Speaker 1-CH Mono/2-CH Stereo/4-CH Stereo 605W Class-D 44-Pin HTSSOP EP; Quiescent Current: 24.0 mA; Lead-Free Status: Lead Free; Manufacturer: Texas Instruments; Lifecycle Status: Active; RoHS: Compliant